# Altium schematic sheet Mram.SchDoc
size 420 x 297 mm; SheetNumber: 18; SheetTotal: 21
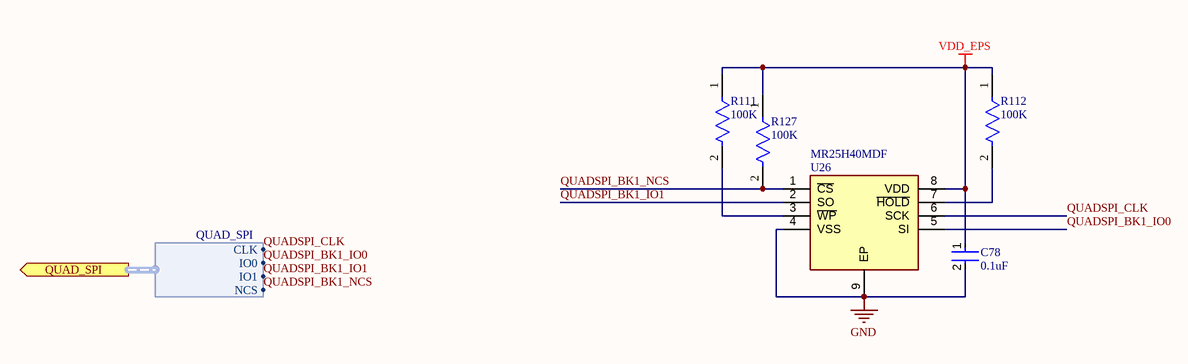
[diagram p0: Mram.SchDoc]

## Parts
C78  0.1uF  [FP-C0603C-CF-MFG]
R111  100K  [FP-ERA3A-MFG]
R112  100K  [FP-ERA3A-MFG]
R127  100K  [FP-ERA3A-MFG]
U26  MR25H40MDF  [SON127P600X500X90-9N-D]

## Ports
QUAD_SPI (out, harness QUAD_SPI)

## Harnesses
QUAD_SPI: CLK, IO0, IO1, NCS

## Nets
GND: C78.2 U26.4(VSS) U26.9(EP)
VDD_EPS: C78.1 R111.1 R112.1 R127.1 U26.8(VDD)
QUADSPI_BK1_IO0: U26.5(SI) ; port QUAD_SPI.IO0
QUADSPI_BK1_IO1: U26.2(SO) ; port QUAD_SPI.IO1
QUADSPI_BK1_NCS: R127.2 U26.1(~{CS}) ; port QUAD_SPI.NCS
QUADSPI_CLK: U26.6(SCK) ; port QUAD_SPI.CLK
NetR111_2: R111.2 U26.3(~{WP})
NetR112_2: R112.2 U26.7(~{HOLD})

## Notes on the sheet
- THIS DOCUMENT AND THE DATA DISCLOSED HEREIN OR
- HEREWITH IS THE PROPERTY OF ALTIUM LIMITED AND MAY
- DWG NO:
- REVISION
- REV:
- DESCRIPTION
- DATE
- APPROVED
- BE FREELY DISTRIBUTED IN WHOLE. NO RIGHTS ARE
- RESERVED OR EXPRESS OR IMPLIED WARANTEE GIVEN.
- ENG:
- APPROVALS
- PROJECT
- DSN:
- CHK:
- REFERENCE DOCUMENTS
- PROJECT REVISION:
- TITLE
- DOCUMENT REVISION:
- DESIGN ITEM:
- BOM:
- FAB DWG:
- PCB DWG:
- ASSY DWG:
- SCALE:
- A3
- SIZE
- CAGE CODE
- FILE NAME
- DWG NO.
- SHEET
- OF
- REV

## Library data of the parts
C78 = CMP-2006-03061-2: CAP CER 0.1UF 50V X7R 0603; Manufacturer: KEMET; Manufacturer Part Number: C0603C104K5RACTU; Tolerance: 0.1; Temperature Coefficient: 30ppm/°C; Material: Ceramic; Automotive Grade: Grade 1; Value: 0.10 μF; Temperature: -55°C to +125°C; RoHS: TRUE; Temperature Range High: +125°C; Lead Free: Yes; Octopart: https://octopart.com/c0603c104k5ractu-kemet-139244; Digikey Description: CAP CER 0.1UF 50V X7R 0603; Category: Cap; Package: C0603C-CF; ComponentLink2Description: Datasheet; Temperature Range Low: -55°C; Device Class L1: Passive Components; Voltage Rating: 50 V; Automotive: Yes; Device Class L3: Ceramic Capacitors; ComponentLink2URL: https://api.kemet.com/component-edge/download/datasheet/C0603C100J5GACAUTO.pdf; Capacitance: 0.10 μF; Device Class L2: Capacitors; Temperature Characteristic: X7R; Height: 0.87mm
R111 R112 R127 = CMP-2000-00875-2: NexarPartId: 1243428; Power Rating: 100mW; Voltage Rating (DC): 75V; Tolerance: 0.1%; Temperature Coefficient: 25ppm/°C; Resistance: 100kΩ; Contact Plating: Tin; Max Operating Temperature: 155°C; Case Code (Imperial): 0603; Packaging: Cut Tape; Width: 800µm; Lead Free: Lead Free; REACH SVHC: No SVHC; Termination: SMD/SMT; Radiation Hardening: No; Length: 1.6mm; Military Standard: Not; Features: Automotive AEC-Q200; Case/Package: 0603; Number of Terminations: 2; Composition: Thin Film; Schedule B: 8533210045, 8533210045; Voltage Rating: 75V; Mount: Surface Mount; Case Code (Metric): 1608; Lifecycle Status: Production; Height: 450µm; RoHS: Compliant; Number of Pins: 2; Max Power Dissipation: 100mW; Min Operating Temperature: -55°C; Depth: 800µm; Working Voltage: 75V
U26 = MR25H40MDF: Integrated Circuit; Manufacturer_Name: Everspin Technologies; Datasheet Link: https://datasheet.datasheetarchive.com/originals/distributors/Datasheets-DGA23/1514724.pdf; Height: 0.9mm; Manufacturer_Part_Number: MR25H40MDF; Mouser Part Number: 936-MR25H40MDF; Mouser Price/Stock: https://www.mouser.co.uk/ProductDetail/Everspin-Technologies/MR25H40MDF?qs=laR3Dyet2Vc5UBOlfE70WA%3D%3D; Arrow Part Number: MR25H40MDF; Arrow Price/Stock: https://www.arrow.com/en/products/mr25h40mdf/everspin-technologies?utm_currency=USD&region=europe